# Altium project FMC_ADC_128CH_10B.PrjPCB (part 1 of 4)
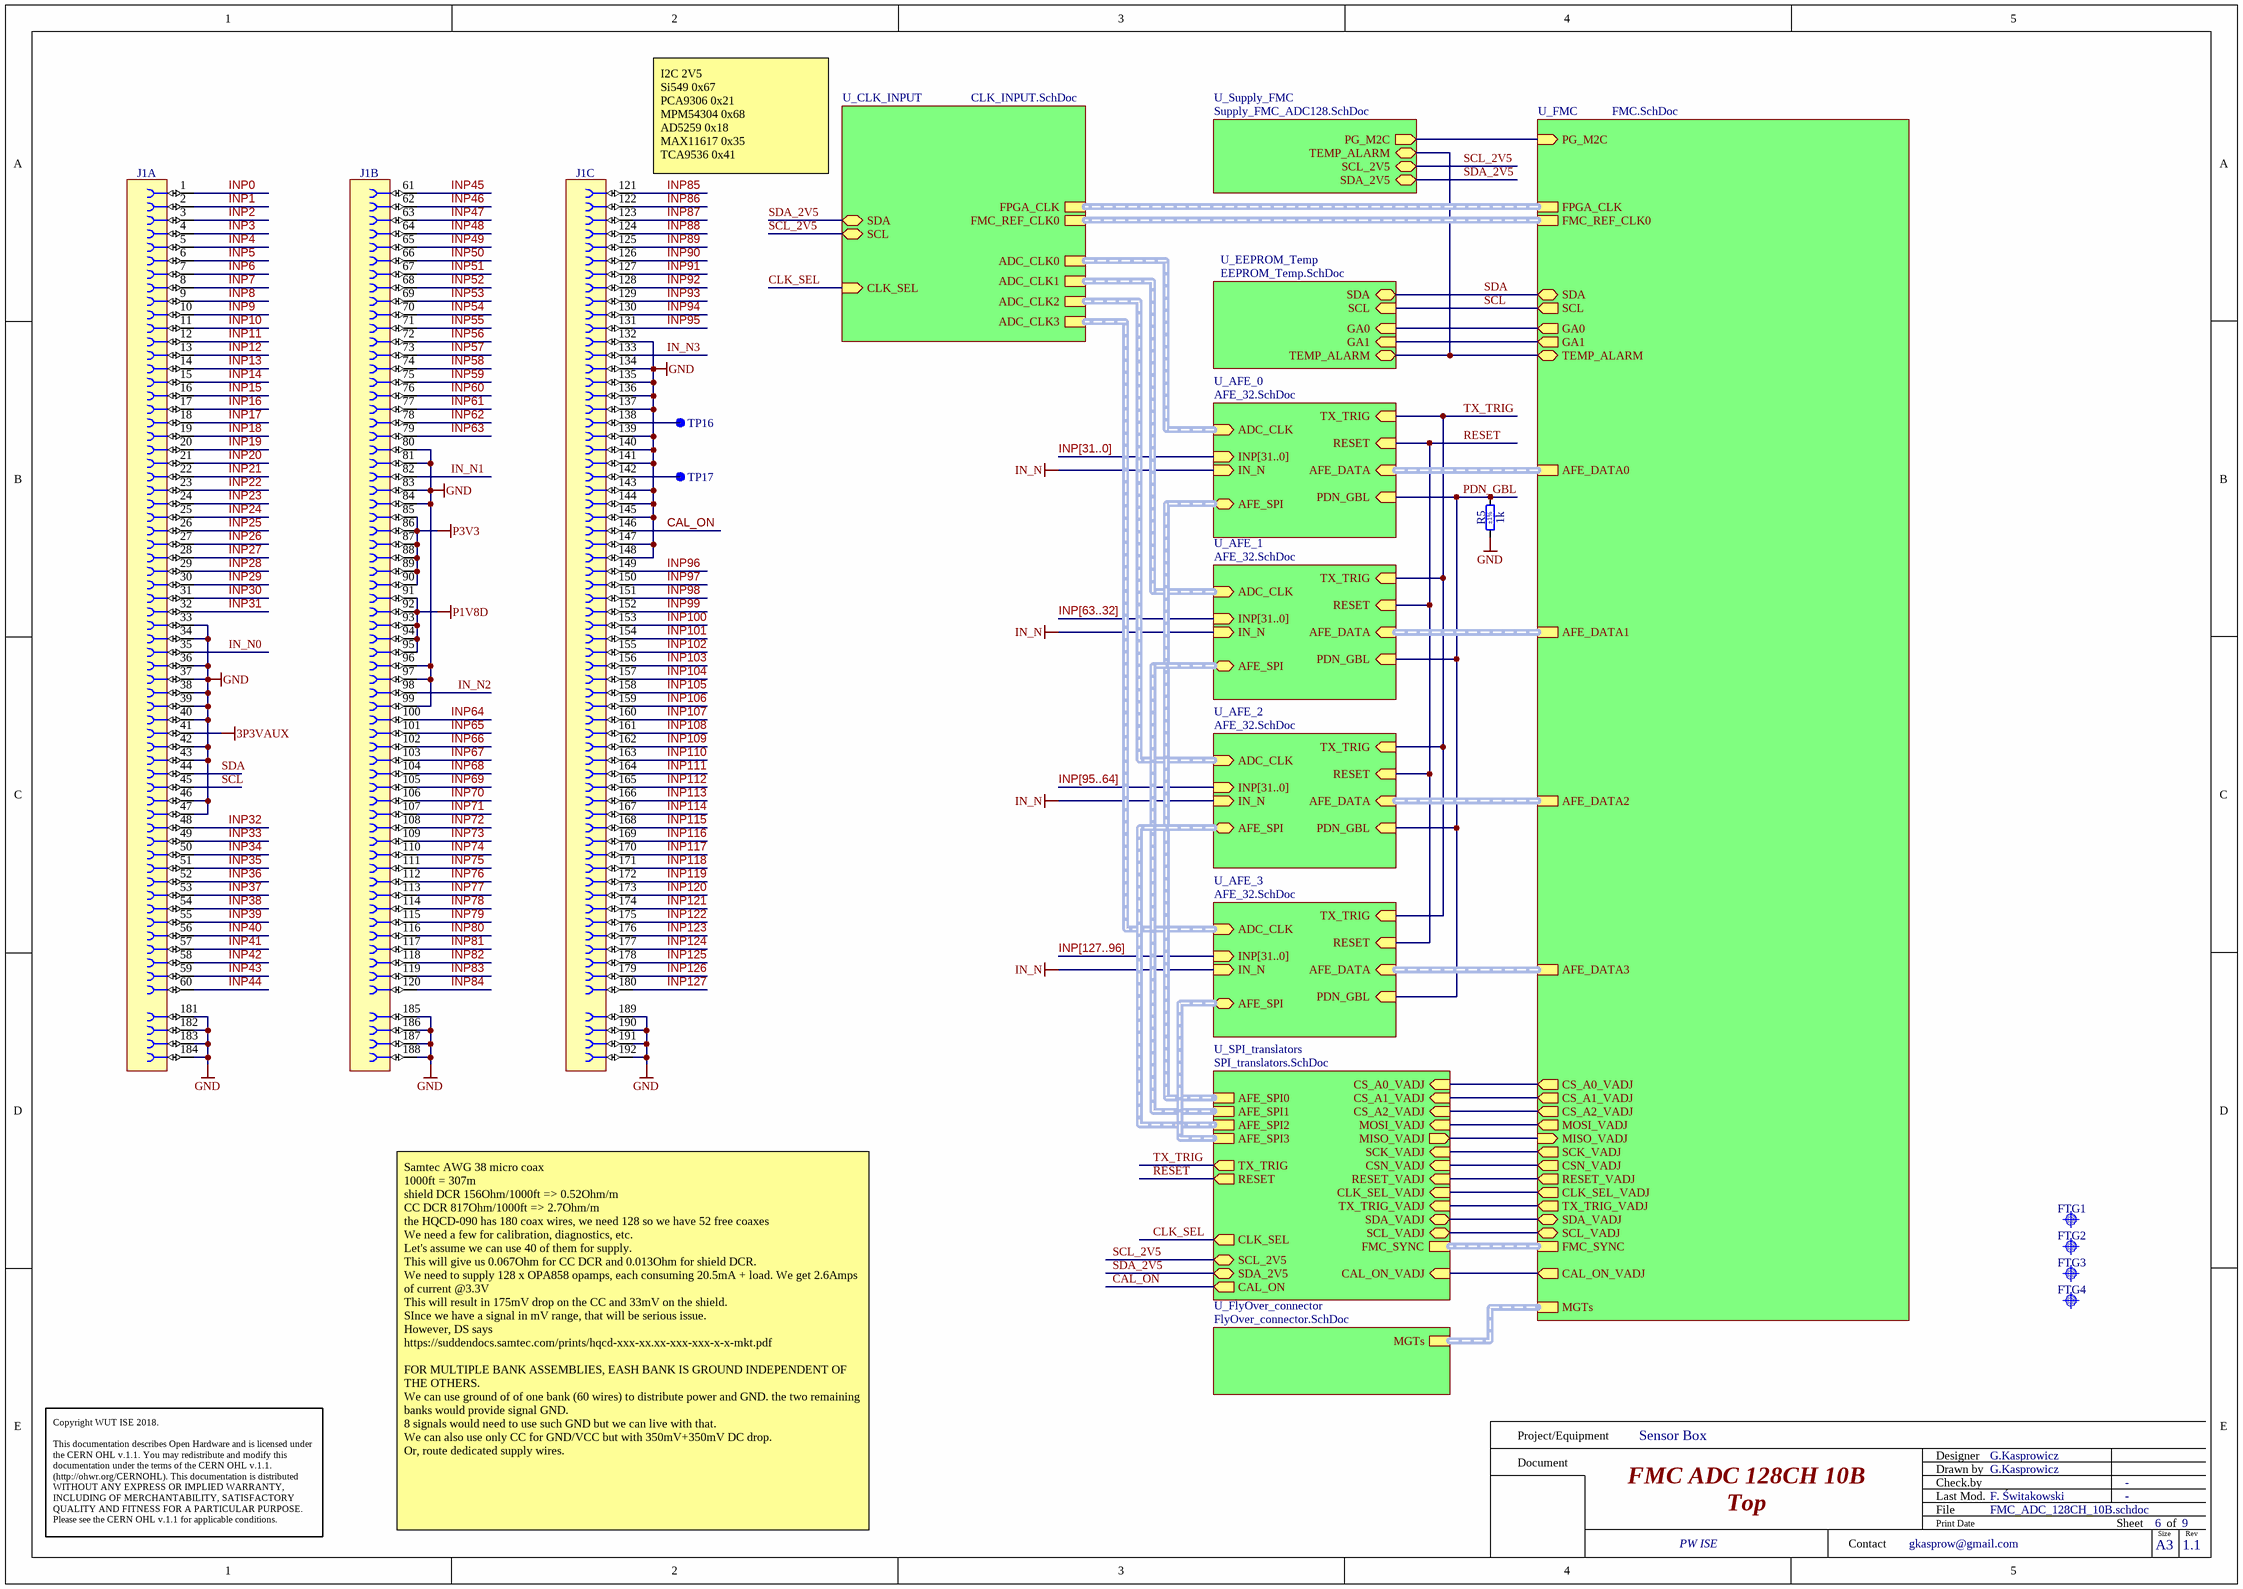
[diagram p0: FMC_ADC_128CH_10B.schdoc]
9 sheets, 821 parts. Net scope: hierarchical (ports join the sheet entries above them; power ports are global).
Board file: FMC_ADC_128CH_10B.PcbDoc
Sheets:
  FMC_ADC_128CH_10B.schdoc
    U_AFE_0 = AFE_32.SchDoc
      U_AFE_32_SUP = AFE_32_SUP.SchDoc
    U_Supply_FMC = Supply_FMC_ADC128.SchDoc
    U_CLK_INPUT = CLK_INPUT.SchDoc
    U_AFE_1 = AFE_32.SchDoc
      U_AFE_32_SUP = AFE_32_SUP.SchDoc
    U_AFE_2 = AFE_32.SchDoc
      U_AFE_32_SUP = AFE_32_SUP.SchDoc
    U_AFE_3 = AFE_32.SchDoc
      U_AFE_32_SUP = AFE_32_SUP.SchDoc
    U_FMC = FMC.SchDoc
    U_EEPROM_Temp = EEPROM_Temp.SchDoc
    U_SPI_translators = SPI_translators.SchDoc
    U_FlyOver_connector = FlyOver_connector.SchDoc

## Sheet FMC_ADC_128CH_10B.schdoc: FMC ADC 128CH 10B
size 420 x 297 mm; EDA_Number: ARTIQ; Projet: ARTIQ/SINARA; Author: G.Kasprowicz; CompanyName: WUT ISE; DrawnBy: G.Kasprowicz; Organization: WUT ISE; Address1: PW ISE; Address2: Nowowiejska 15/19 00-665 Warsaw; Address3: gkasprow@gmail.com; DocumentNumber: 6; Revision: 1.1; SheetNumber: 6; SheetTotal: 9; ModifiedBy: F. Świtakowski; CheckedDate: -; Title2: Top; DivGrp: WUT ISE; Designer: G.Kasprowicz; ModifiedDate: -; ProjectName: Sensor Box

### Parts
FTG1  Use only in PCB  [FIDUCIAL_TOP_C100-200]  (value not drawn)  (no BOM)
FTG2  Use only in PCB  [FIDUCIAL_TOP_S100-200]  (value not drawn)  (no BOM)
FTG3  Use only in PCB  [FIDUCIAL_TOP_C100-200]  (value not drawn)  (no BOM)
FTG4  Use only in PCB  [FIDUCIAL_TOP_S100-200]  (value not drawn)  (no BOM)
J1  (no value)  [SAMTEC_QSH-090-01-L-D-A]  (parts A,B,C of 3)
R5  1k  Tolerance: ±1%  [RESC1005X40N]
TP16  SMD Pad  [C100]  (value not drawn)
TP17  SMD Pad  [C100]  (value not drawn)

### Sub-sheets
U_AFE_0 = AFE_32.SchDoc: PDN_GBL (in), ADC_CLK (in, harness DIFF), INP[31..0] (in), AFE_DATA (in, harness AFE_DATA), RESET (in), AFE_SPI (bidir, harness AFE_SPI), TX_TRIG (in), IN_N (in)
U_AFE_1 = AFE_32.SchDoc: PDN_GBL (in), ADC_CLK (in, harness DIFF), INP[31..0] (in), AFE_DATA (in, harness AFE_DATA), RESET (in), AFE_SPI (bidir, harness AFE_SPI), TX_TRIG (in), IN_N (in)
U_AFE_2 = AFE_32.SchDoc: PDN_GBL (in), ADC_CLK (in, harness DIFF), INP[31..0] (in), AFE_DATA (in, harness AFE_DATA), RESET (in), AFE_SPI (bidir, harness AFE_SPI), TX_TRIG (in), IN_N (in)
U_AFE_3 = AFE_32.SchDoc: PDN_GBL (in), ADC_CLK (in, harness DIFF), INP[31..0] (in), AFE_DATA (in, harness AFE_DATA), RESET (in), AFE_SPI (bidir, harness AFE_SPI), TX_TRIG (in), IN_N (in)
U_CLK_INPUT = CLK_INPUT.SchDoc: ADC_CLK0 (harness DIFFCLK), ADC_CLK1 (harness DIFFCLK), ADC_CLK2 (harness DIFFCLK), ADC_CLK3 (harness DIFFCLK), FMC_REF_CLK0 (harness DIFFCLK), FPGA_CLK (harness DIFFCLK), SCL (bidir), CLK_SEL (in), SDA (bidir)
U_EEPROM_Temp = EEPROM_Temp.SchDoc: SDA (bidir), SCL (in), GA0 (in), GA1 (in), TEMP_ALARM (bidir)
U_FlyOver_connector = FlyOver_connector.SchDoc: MGTs (harness MGTs)
U_FMC = FMC.SchDoc: GA0 (out), GA1 (out), SDA (bidir), SCL (out), TEMP_ALARM (bidir), FPGA_CLK (harness DIFF), PG_M2C (in), FMC_SYNC (harness DIFF), FMC_REF_CLK0 (harness DIFF), AFE_DATA0 (harness AFE_DATA), AFE_DATA1 (harness AFE_DATA), AFE_DATA2 (harness AFE_DATA), AFE_DATA3 (harness AFE_DATA), CS_A0_VADJ (out), CS_A1_VADJ (out), CS_A2_VADJ (out), MOSI_VADJ (out), MISO_VADJ (in), SCK_VADJ (out), RESET_VADJ (out), TX_TRIG_VADJ (out), SDA_VADJ (bidir), SCL_VADJ (bidir), CSN_VADJ (out), CLK_SEL_VADJ (out), CAL_ON_VADJ (out), MGTs (harness MGTs)
U_SPI_translators = SPI_translators.SchDoc: AFE_SPI0 (harness AFE_SPI), AFE_SPI1 (harness AFE_SPI), AFE_SPI2 (harness AFE_SPI), AFE_SPI3 (harness AFE_SPI), TX_TRIG (out), RESET (out), MOSI_VADJ (in), SCK_VADJ (in), RESET_VADJ (in), CS_A0_VADJ (in), CS_A1_VADJ (in), MISO_VADJ (out), CS_A2_VADJ (in), TX_TRIG_VADJ (in), CSN_VADJ (in), SCL_VADJ (bidir), SDA_VADJ (bidir), CLK_SEL (out), CLK_SEL_VADJ (in), FMC_SYNC (harness DIFF), CAL_ON_VADJ (in), SCL_2V5 (bidir), SDA_2V5 (bidir), CAL_ON (out)
U_Supply_FMC = Supply_FMC_ADC128.SchDoc: PG_M2C (out), TEMP_ALARM (bidir), SCL_2V5 (bidir), SDA_2V5 (bidir)

### Nets
3P3VAUX: J1.41
GND: J1.33 J1.34 J1.36 J1.37 J1.38 J1.39 J1.40 J1.42 J1.43 J1.46 J1.47 J1.80 J1.81 J1.83 J1.84 J1.96 J1.97 J1.99 J1.132 J1.134 J1.135 J1.136 J1.137 J1.139 J1.140 J1.141 J1.143 J1.144 J1.145 J1.147 J1.148 J1.181 J1.182 J1.183 J1.184 J1.185 J1.186 J1.187 J1.188 J1.189 J1.190 J1.191 J1.192 R5.1
IN_N: sheet U_AFE_0/IN_N, sheet U_AFE_1/IN_N, sheet U_AFE_2/IN_N, sheet U_AFE_3/IN_N
P1V8D: J1.91 J1.92 J1.93 J1.94 J1.95
P3V3: J1.85 J1.86 J1.87 J1.88 J1.89 J1.90
CAL_ON: J1.146 ; sheet U_SPI_translators/CAL_ON
CLK_SEL: sheet U_CLK_INPUT/CLK_SEL, sheet U_SPI_translators/CLK_SEL
EN_PWR: sheet U_Supply_FMC/TEMP_ALARM, sheet U_FMC/TEMP_ALARM, sheet U_EEPROM_Temp/TEMP_ALARM
GA0: sheet U_FMC/GA0, sheet U_EEPROM_Temp/GA0
GA1: sheet U_FMC/GA1, sheet U_EEPROM_Temp/GA1
HA19_N: sheet U_FMC/CS_A0_VADJ, sheet U_SPI_translators/CS_A0_VADJ
HA19_P: sheet U_FMC/CSN_VADJ, sheet U_SPI_translators/CSN_VADJ
HA20_N: sheet U_FMC/CS_A2_VADJ, sheet U_SPI_translators/CS_A2_VADJ
HA20_P: sheet U_FMC/CS_A1_VADJ, sheet U_SPI_translators/CS_A1_VADJ
HA21_N: sheet U_FMC/SCK_VADJ, sheet U_SPI_translators/SCK_VADJ
HA21_P: sheet U_FMC/MOSI_VADJ, sheet U_SPI_translators/MOSI_VADJ
HA22_N: sheet U_FMC/RESET_VADJ, sheet U_SPI_translators/RESET_VADJ
HA22_P: sheet U_FMC/MISO_VADJ, sheet U_SPI_translators/MISO_VADJ
HA23_P: sheet U_FMC/TX_TRIG_VADJ, sheet U_SPI_translators/TX_TRIG_VADJ
HB20_N: sheet U_FMC/CAL_ON_VADJ, sheet U_SPI_translators/CAL_ON_VADJ
HB20_P: sheet U_FMC/SDA_VADJ, sheet U_SPI_translators/SDA_VADJ
HB21_N: sheet U_FMC/SCL_VADJ, sheet U_SPI_translators/SCL_VADJ
HB21_P: sheet U_FMC/CLK_SEL_VADJ, sheet U_SPI_translators/CLK_SEL_VADJ
IN_N0: J1.35
IN_N1: J1.82
IN_N2: J1.98
IN_N3: J1.133
INP0: J1.1
INP1: J1.2
INP2: J1.3
INP3: J1.4
INP4: J1.5
INP5: J1.6
INP6: J1.7
INP7: J1.8
INP8: J1.9
INP9: J1.10
INP10: J1.11
INP11: J1.12
INP12: J1.13
INP13: J1.14
INP14: J1.15
INP15: J1.16
INP16: J1.17
INP17: J1.18
INP18: J1.19
INP19: J1.20
INP20: J1.21
INP21: J1.22
INP22: J1.23
INP23: J1.24
INP24: J1.25
INP25: J1.26
INP26: J1.27
INP27: J1.28
INP28: J1.29
INP29: J1.30
INP30: J1.31
INP31: J1.32
INP32: J1.48  [project net INP0]
INP33: J1.49  [project net INP1]
INP34: J1.50  [project net INP2]
INP35: J1.51  [project net INP3]
INP36: J1.52
INP37: J1.53
INP38: J1.54
INP39: J1.55
INP40: J1.56
INP41: J1.57
INP42: J1.58  [project net INP10]
INP43: J1.59  [project net INP11]
INP44: J1.60  [project net INP12]
INP45: J1.61  [project net INP13]
INP46: J1.62  [project net INP14]
INP47: J1.63  [project net INP15]
INP48: J1.64  [project net INP16]
INP49: J1.65  [project net INP17]
INP50: J1.66  [project net INP18]
INP51: J1.67  [project net INP19]
INP52: J1.68  [project net INP20]
INP53: J1.69  [project net INP21]
INP54: J1.70  [project net INP22]
INP55: J1.71  [project net INP23]
INP56: J1.72  [project net INP24]
INP57: J1.73  [project net INP25]
INP58: J1.74  [project net INP26]
INP59: J1.75  [project net INP27]
INP60: J1.76  [project net INP28]
INP61: J1.77  [project net INP29]
INP62: J1.78  [project net INP30]
INP63: J1.79  [project net INP31]
INP64: J1.100  [project net INP0]
INP65: J1.101  [project net INP1]
INP66: J1.102  [project net INP2]
INP67: J1.103  [project net INP3]
INP68: J1.104  [project net INP4]
INP69: J1.105  [project net INP5]
INP70: J1.106  [project net INP6]
INP71: J1.107  [project net INP7]
INP72: J1.108
INP73: J1.109
INP74: J1.110  [project net INP10]
INP75: J1.111  [project net INP11]
INP76: J1.112  [project net INP12]
INP77: J1.113  [project net INP13]
INP78: J1.114  [project net INP14]
INP79: J1.115  [project net INP15]
INP80: J1.116  [project net INP16]
INP81: J1.117  [project net INP17]
INP82: J1.118  [project net INP18]
INP83: J1.119  [project net INP19]
INP84: J1.120  [project net INP20]
INP85: J1.121  [project net INP21]
INP86: J1.122  [project net INP22]
INP87: J1.123  [project net INP23]
INP88: J1.124  [project net INP24]
INP89: J1.125  [project net INP25]
INP90: J1.126  [project net INP26]
INP91: J1.127  [project net INP27]
INP92: J1.128  [project net INP28]
INP93: J1.129  [project net INP29]
INP94: J1.130  [project net INP30]
INP95: J1.131  [project net INP31]
INP96: J1.149  [project net INP0]
INP97: J1.150  [project net INP1]
INP98: J1.151  [project net INP2]
INP99: J1.152  [project net INP3]
INP100: J1.153
INP101: J1.154
INP102: J1.155
INP103: J1.156
INP104: J1.157
INP105: J1.158
INP106: J1.159  [project net INP10]
INP107: J1.160
INP108: J1.161
INP109: J1.162
INP110: J1.163
INP111: J1.164
INP112: J1.165
INP113: J1.166
INP114: J1.167
INP115: J1.168
INP116: J1.169
INP117: J1.170
INP118: J1.171
INP119: J1.172
INP120: J1.173
INP121: J1.174
INP122: J1.175
INP123: J1.176
INP124: J1.177
INP125: J1.178
INP126: J1.179
INP127: J1.180
PDN_GBL: R5.2 ; sheet U_AFE_0/PDN_GBL, sheet U_AFE_1/PDN_GBL, sheet U_AFE_2/PDN_GBL, sheet U_AFE_3/PDN_GBL
PG_M2C: sheet U_Supply_FMC/PG_M2C, sheet U_FMC/PG_M2C
RESET: sheet U_AFE_0/RESET, sheet U_AFE_1/RESET, sheet U_AFE_2/RESET, sheet U_AFE_3/RESET, sheet U_SPI_translators/RESET
SCL: J1.45 ; sheet U_FMC/SCL, sheet U_EEPROM_Temp/SCL
SCL_2V5: sheet U_Supply_FMC/SCL_2V5, sheet U_CLK_INPUT/SCL, sheet U_SPI_translators/SCL_2V5
SDA: J1.44 ; sheet U_FMC/SDA, sheet U_EEPROM_Temp/SDA
SDA_2V5: sheet U_Supply_FMC/SDA_2V5, sheet U_CLK_INPUT/SDA, sheet U_SPI_translators/SDA_2V5
TX_TRIG: sheet U_AFE_0/TX_TRIG, sheet U_AFE_1/TX_TRIG, sheet U_AFE_2/TX_TRIG, sheet U_AFE_3/TX_TRIG, sheet U_SPI_translators/TX_TRIG
NetJ1_138: J1.138 TP16.1
NetJ1_142: J1.142 TP17.1

### Buses and harness runs
bus INP[31..0] = sheet U_AFE_0/INP[31..0]
bus INP[63..32] = sheet U_AFE_1/INP[31..0]
bus INP[95..64] = sheet U_AFE_2/INP[31..0]
bus INP[127..96] = sheet U_AFE_3/INP[31..0]
harness sheet U_AFE_0/ADC_CLK = sheet U_CLK_INPUT/ADC_CLK0
harness sheet U_AFE_0/AFE_DATA = sheet U_FMC/AFE_DATA0
harness sheet U_AFE_0/AFE_SPI = sheet U_SPI_translators/AFE_SPI0
harness sheet U_AFE_1/ADC_CLK = sheet U_CLK_INPUT/ADC_CLK1
harness sheet U_AFE_1/AFE_DATA = sheet U_FMC/AFE_DATA1
harness sheet U_AFE_1/AFE_SPI = sheet U_SPI_translators/AFE_SPI1
harness sheet U_AFE_2/ADC_CLK = sheet U_CLK_INPUT/ADC_CLK2
harness sheet U_AFE_2/AFE_DATA = sheet U_FMC/AFE_DATA2
harness sheet U_AFE_2/AFE_SPI = sheet U_SPI_translators/AFE_SPI2
harness sheet U_AFE_3/ADC_CLK = sheet U_CLK_INPUT/ADC_CLK3
harness sheet U_AFE_3/AFE_DATA = sheet U_FMC/AFE_DATA3
harness sheet U_AFE_3/AFE_SPI = sheet U_SPI_translators/AFE_SPI3
harness sheet U_CLK_INPUT/FMC_REF_CLK0 = sheet U_FMC/FMC_REF_CLK0
harness sheet U_CLK_INPUT/FPGA_CLK = sheet U_FMC/FPGA_CLK
harness sheet U_FlyOver_connector/MGTs = sheet U_FMC/MGTs
harness sheet U_FMC/FMC_SYNC = sheet U_SPI_translators/FMC_SYNC

### Notes on the sheet
- (near J1) I2C 2V5
  Si549 0x67
  PCA9306 0x21
  MPM54304 0x68
  AD5259 0x18
  MAX11617 0x35
  TCA9536 0x41
- Samtec AWG 38 micro coax
  1000ft = 307m
  shield DCR 156Ohm/1000ft => 0.52Ohm/m
  CC DCR 817Ohm/1000ft => 2.7Ohm/m
  the HQCD-090 has 180 coax wires, we need 128 so we have 52 free coaxes
  We need a few for calibration, diagnostics, etc.
  Let's assume we can use 40 of them for supply.
  This will give us 0.067Ohm for CC DCR and 0.013Ohm for shield DCR.
  We need to supply 128 x OPA858 opamps, each consuming 20.5mA + load. We get 2.6Amps of current @3.3V
  This will result in 175mV drop on the CC and 33mV on the shield.
  SInce we have a signal in mV range, that will be serious issue.
  However, DS says
  https://suddendocs.samtec.com/prints/hqcd-xxx-xx.xx-xxx-xxx-x-x-mkt.pdf
  FOR MULTIPLE BANK ASSEMBLIES, EASH BANK IS GROUND INDEPENDENT OF THE OTHERS.
  We can use ground of of one bank (60 wires) to distribute power and GND. the two remaining banks would provide signal GND.
  8 signals would need to use such GND but we can live with that.
  We can also use only CC for GND/VCC but with 350mV+350mV DC drop.
  Or, route dedicated supply wires.
- Project/Equipment
- Document
- Designer
- Drawn by
- Check.by
- Copyright WUT ISE 2018.
  This documentation describes Open Hardware and is licensed under the CERN OHL v.1.1. You may redistribute and modify this documentation under the terms of the CERN OHL v.1.1. (http://ohwr.org/CERNOHL). This documentation is distributed WITHOUT ANY EXPRESS OR IMPLIED WARRANTY, INCLUDING OF MERCHANTABILITY, SATISFACTORY QUALITY AND FITNESS FOR A PARTICULAR PURPOSE. Please see the CERN OHL v.1.1 for applicable conditions.
- Contact
- File
- Last Mod.
- Print Date
- Sheet
- Size
- A3
- of
- Rev

### Library data of the parts
FTG1 FTG3 = FIDUCIAL_TARGET_C100-200: Fiducial Target; Part Description: Round Fiducial Target, Top Layer, 1.0mm, Top Solder 2.0mm, Keepout =2.0mm; Mounted: No; Part Number: FIDUCIAL_TARGET_C100-200; Component Type: Standard (No BOM); Pin Count: 1; Family: Fiducial; Socket: No; SMD: Yes; Sense: No; Status: None; ComponentHeight: 0mm; HelpURL: Undefined; Author: CERN DEM JLC; CreateDate: 09.02.2010; LatestRevisionDate: 04.04.2012; PackageDescription: Round Fiducial Target, Top Layer, 1.0mm, Top Solder 2.0mm, Keepout =2.0mm
FTG2 FTG4 = FIDUCIAL_TARGET_S100-200: Fiducial Target; Part Description: Square Fiducial Target, Top Layer, 1.0mm, Top Solder 2.0mm, Keepout =2.0mm; Mounted: No; Part Number: FIDUCIAL_TARGET_S100-200; Component Type: Standard (No BOM); Pin Count: 1; Family: Fiducial; Socket: No; SMD: Yes; Sense: No; Status: None; ComponentHeight: 0mm; HelpURL: Undefined; Author: CERN DEM JLC; CreateDate: 09.02.2010; LatestRevisionDate: 04.04.2012; PackageDescription: Square Fiducial Target, Top Layer, 1.0mm, Top Solder 2.0mm, Keepout =2.0mm
J1 = SAMTEC_QSH-090-01-L-D-A: Connector 180 Female (3x60) + 3x4 GND; Part Description: 180 Contacts ((2X30)x3), Pitch 0.5mm, Straight Double Row High Speed Ground Plane Socket; Manufacturer: SAMTEC; PressFit: No; Part Number: SAMTEC_QSH-090-01-L-D-A; Component Kind: Standard; Component Type: Standard; Pin Count: 192; Mounted: Yes; Socket: No; SMD: Yes; Sense: No; Status: None; Manufacturer Part Number: QSH-090-01-L-D-A; ComponentHeight: 3.25mm; HelpURL: \\cern.ch\dfs\Applications\Altium\Datasheets\SAMTEC_QSH-090-01-L-D-A.pdf; Author: CERN DEM MR; CreateDate: 08.09.2017; LatestRevisionDate: 08.09.2017
R5 = R0402_1K_1%_0.0625W_100PPM: Resistor - 1%; Part Description: General Purpose Thick Film Chip Resistor; Manufacturer: GENERIC; Manufacturer1 Part Number: 232270671002L; TC: ±100ppm/°C; PressFit: No; Part Number: R0402_1K_1%_0.0625W_100PPM; Component Kind: Standard; Component Type: Standard; Pin Count: 2; Value: 1k; Status: Not Recommended; Power: 0.0625W; Manufacturer Part Number: R0402_1K_1%_0.0625W_100PPM; Case: 0402; Mounted: Yes; Sense: No; Socket: No; SMD: Yes; Manufacturer1 Example: YAGEO PHYCOMP; Manufacturer1 ComponentHeight: 0.4mm; HelpURL: \\cern.ch\dfs\Applications\Altium\Datasheets\R0402_Phycomp_RC0402.pdf; Author: CERN DEM JLC; CreateDate: 03.12.2007; LatestRevisionDate: 17.10.2012
TP16 TP17 = SMD_PAD_D1MM: Pad; Part Description: 1mm Diameter SMD Pad; Mounted: No; Part Number: SMD_PAD_D1MM; Component Kind: Standard (No BOM); Component Type: Standard (No BOM); Pin Count: 1; Family: SMD Pad; Socket: No; SMD: Yes; Sense: No; Status: None; ComponentHeight: 0mm; HelpURL: Undefined; Author: CERN DEM JLC; CreateDate: 10.10.2017; LatestRevisionDate: 10.10.2017; PackageDescription: 1mm Diameter SMD Pad

## Sheet AFE_32.SchDoc: FMC ADC 128CH 10B
size 420 x 297 mm; Author: G.Kasprowicz; CompanyName: WUT ISE; DrawnBy: G.Kasprowicz; Organization: WUT ISE; Address1: PW ISE; Address2: Nowowiejska 15/19 00-665 Warsaw; Address3: gkasprow@gmail.com; DocumentNumber: 2; Revision: 1; SheetNumber: 2; SheetTotal: 9; ModifiedBy: -; CheckedDate: -; Title2: AFE 32CH; DivGrp: WUT ISE; Designer: G.Kasprowicz; ModifiedDate: -; ProjectName: Sensor Box
Used 4 times, as channels U_AFE_0, U_AFE_1, U_AFE_2, U_AFE_3. Parts and nets are listed once, with the designators drawn on the sheet.
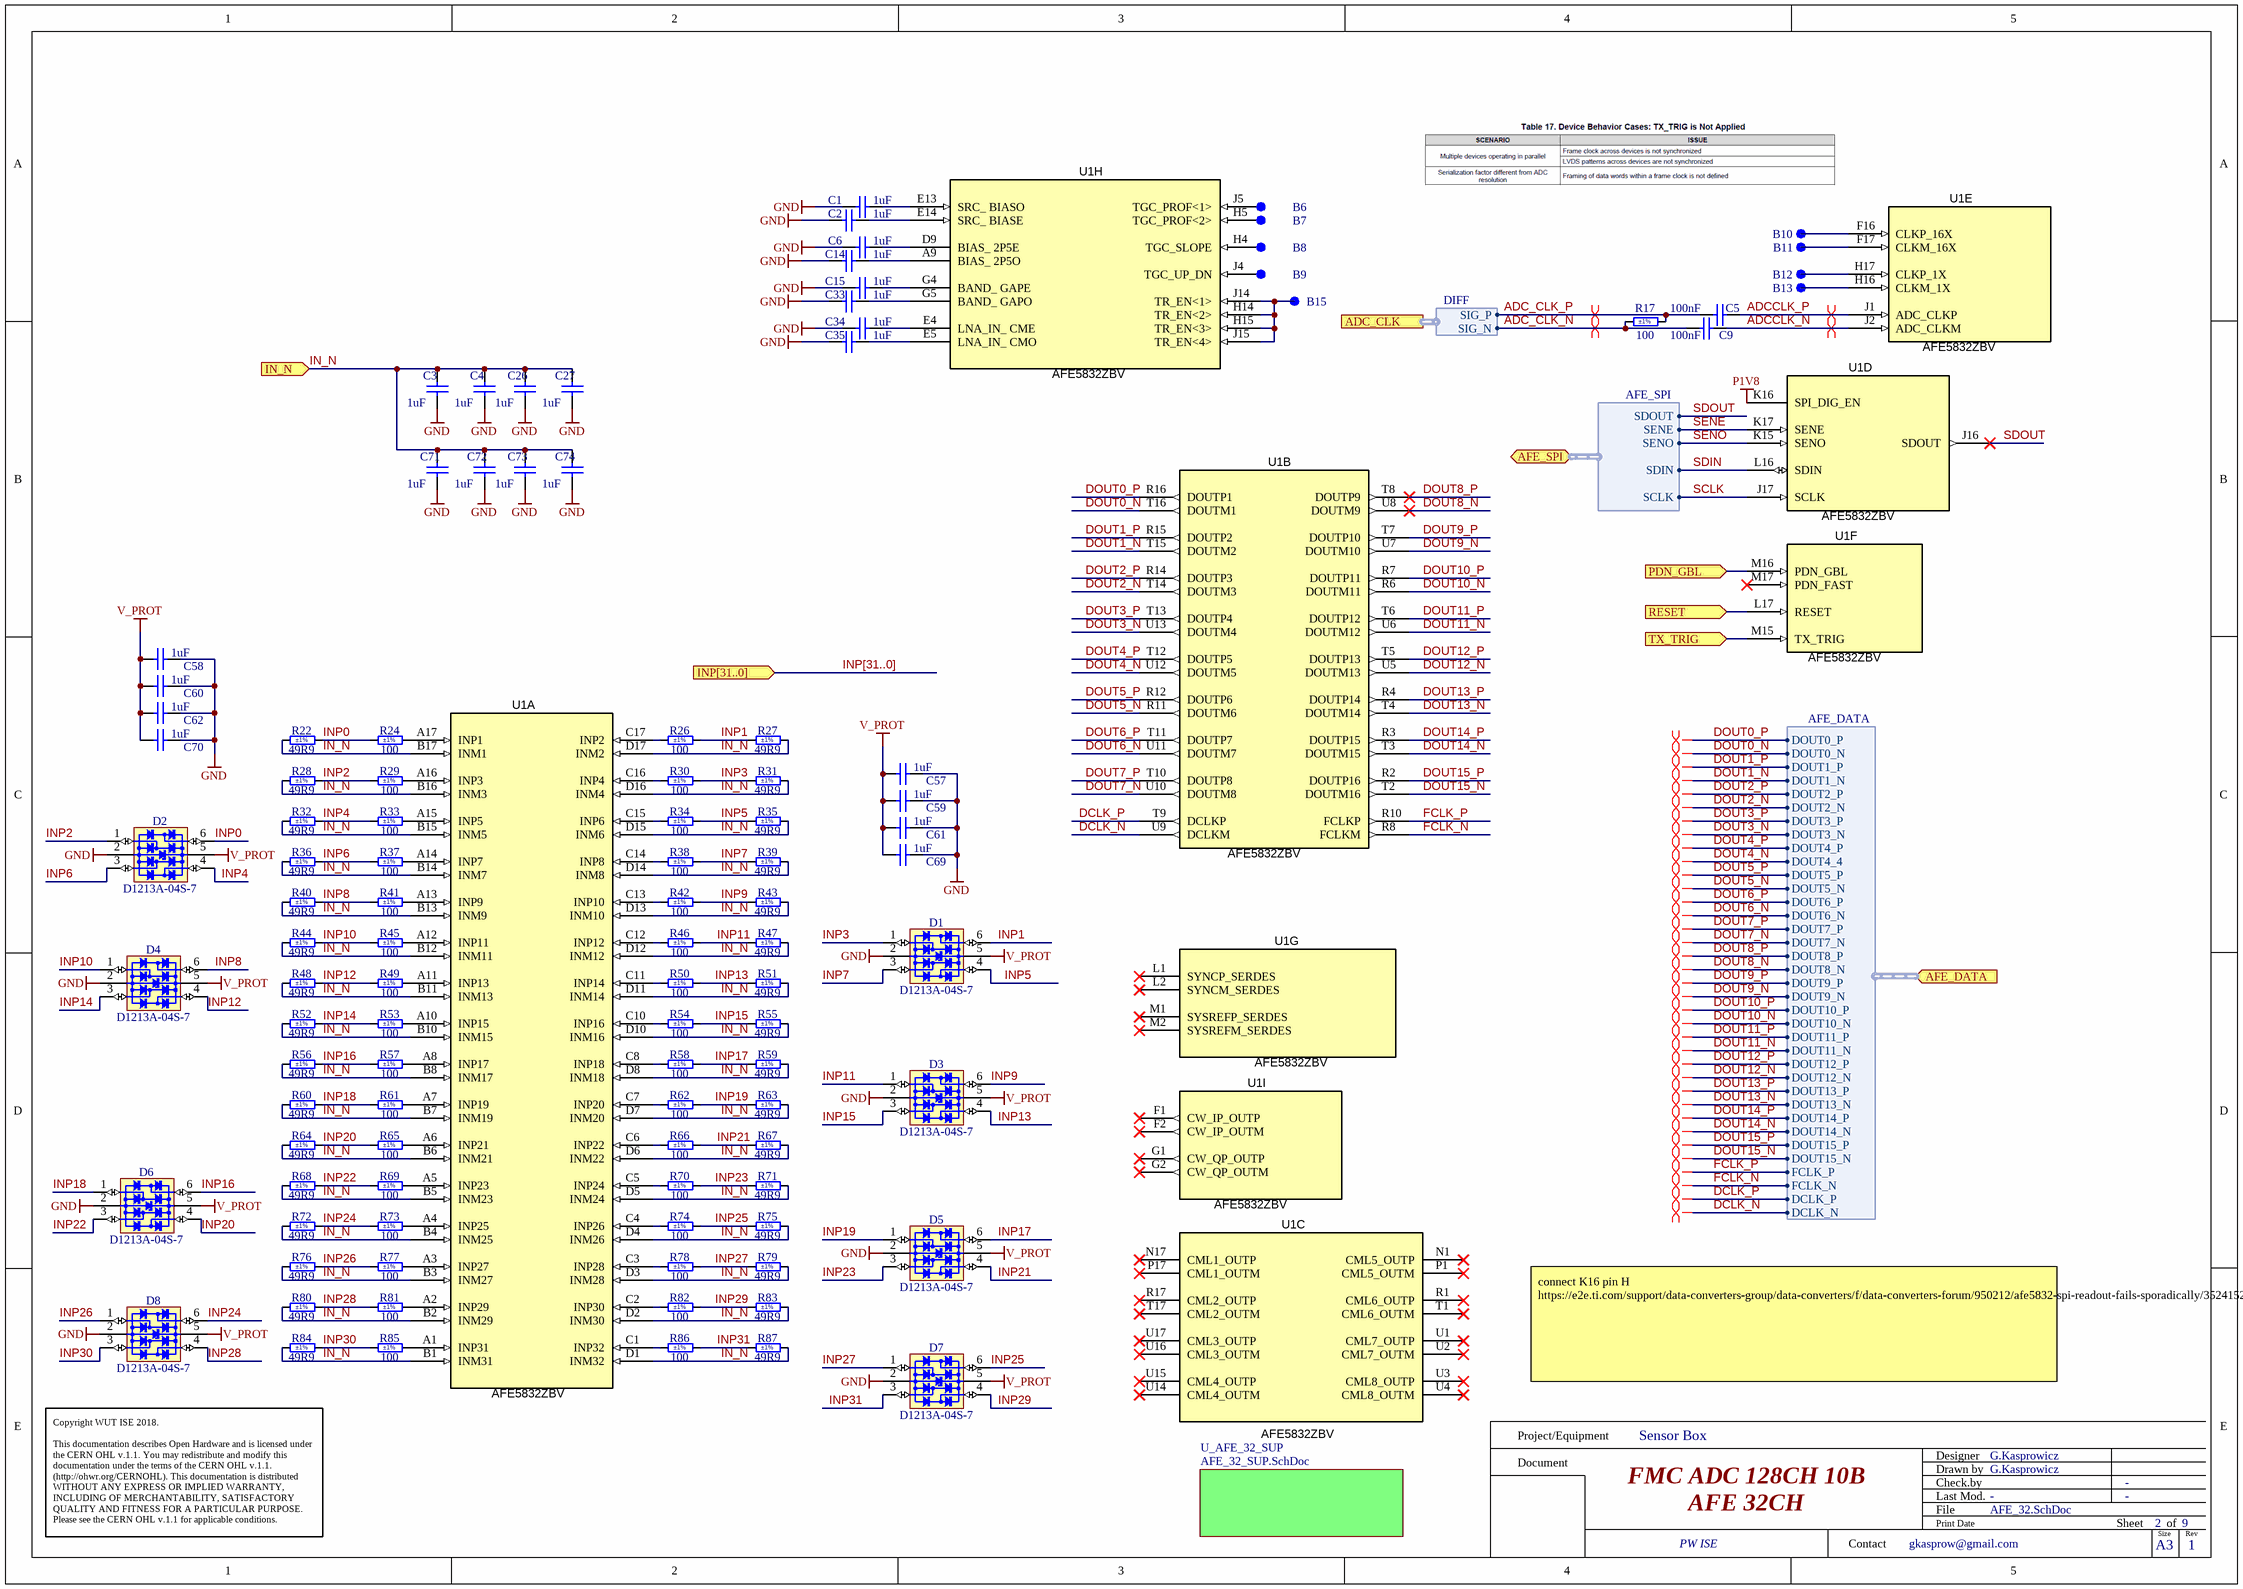
[diagram p1: AFE_32.SchDoc]

### Parts
B6  SMD Pad  [C75]  (value not drawn)  (no BOM)
B7  SMD Pad  [C75]  (value not drawn)  (no BOM)
B8  SMD Pad  [C75]  (value not drawn)  (no BOM)
B9  SMD Pad  [C75]  (value not drawn)  (no BOM)
B10  SMD Pad  [C75]  (value not drawn)  (no BOM)
B11  SMD Pad  [C75]  (value not drawn)  (no BOM)
B12  SMD Pad  [C75]  (value not drawn)  (no BOM)
B13  SMD Pad  [C75]  (value not drawn)  (no BOM)
B15  SMD Pad  [C75]  (value not drawn)  (no BOM)
C1  1uF  [CAPC1005X55N]
C2  1uF  [CAPC1005X55N]
C3  1uF  [CAPC1005X55N]
C4  1uF  [CAPC1005X55N]
C5  100nF  [CAPC0603X33N]
C6  1uF  [CAPC1005X55N]
C9  100nF  [CAPC0603X33N]
C14  1uF  [CAPC1005X55N]
C15  1uF  [CAPC1005X55N]
C26  1uF  [CAPC1005X55N]
C27  1uF  [CAPC1005X55N]
C33  1uF  [CAPC1005X55N]
C34  1uF  [CAPC1005X55N]
C35  1uF  [CAPC1005X55N]
C57  1uF  [CAPC1005X55N]
C58  1uF  [CAPC1005X55N]
C59  1uF  [CAPC1005X55N]
C60  1uF  [CAPC1005X55N]
C61  1uF  [CAPC1005X55N]
C62  1uF  [CAPC1005X55N]
C69  1uF  [CAPC1005X55N]
C70  1uF  [CAPC1005X55N]
C71  1uF  [CAPC1005X55N]
C72  1uF  [CAPC1005X55N]
C73  1uF  [CAPC1005X55N]
C74  1uF  [CAPC1005X55N]
D1  D1213A-04S-7  [SOT65P210X110-6N]
D2  D1213A-04S-7  [SOT65P210X110-6N]
D3  D1213A-04S-7  [SOT65P210X110-6N]
D4  D1213A-04S-7  [SOT65P210X110-6N]
D5  D1213A-04S-7  [SOT65P210X110-6N]
D6  D1213A-04S-7  [SOT65P210X110-6N]
D7  D1213A-04S-7  [SOT65P210X110-6N]
D8  D1213A-04S-7  [SOT65P210X110-6N]
R17  100  Tolerance: ±1%  [RESC1005X40N]
R22  49R9  Tolerance: ±1%  [RESC0603X28N]
R24  100  Tolerance: ±1%  [RESC0603X28N]
R26  100  Tolerance: ±1%  [RESC0603X28N]
R27  49R9  Tolerance: ±1%  [RESC0603X28N]
R28  49R9  Tolerance: ±1%  [RESC0603X28N]
R29  100  Tolerance: ±1%  [RESC0603X28N]
R30  100  Tolerance: ±1%  [RESC0603X28N]
R31  49R9  Tolerance: ±1%  [RESC0603X28N]
R32  49R9  Tolerance: ±1%  [RESC0603X28N]
R33  100  Tolerance: ±1%  [RESC0603X28N]
R34  100  Tolerance: ±1%  [RESC0603X28N]
R35  49R9  Tolerance: ±1%  [RESC0603X28N]
R36  49R9  Tolerance: ±1%  [RESC0603X28N]
R37  100  Tolerance: ±1%  [RESC0603X28N]
R38  100  Tolerance: ±1%  [RESC0603X28N]
R39  49R9  Tolerance: ±1%  [RESC0603X28N]
R40  49R9  Tolerance: ±1%  [RESC0603X28N]
R41  100  Tolerance: ±1%  [RESC0603X28N]
R42  100  Tolerance: ±1%  [RESC0603X28N]
R43  49R9  Tolerance: ±1%  [RESC0603X28N]
R44  49R9  Tolerance: ±1%  [RESC0603X28N]
R45  100  Tolerance: ±1%  [RESC0603X28N]
R46  100  Tolerance: ±1%  [RESC0603X28N]
R47  49R9  Tolerance: ±1%  [RESC0603X28N]
R48  49R9  Tolerance: ±1%  [RESC0603X28N]
R49  100  Tolerance: ±1%  [RESC0603X28N]
R50  100  Tolerance: ±1%  [RESC0603X28N]
R51  49R9  Tolerance: ±1%  [RESC0603X28N]
R52  49R9  Tolerance: ±1%  [RESC0603X28N]
R53  100  Tolerance: ±1%  [RESC0603X28N]
R54  100  Tolerance: ±1%  [RESC0603X28N]
R55  49R9  Tolerance: ±1%  [RESC0603X28N]
R56  49R9  Tolerance: ±1%  [RESC0603X28N]
R57  100  Tolerance: ±1%  [RESC0603X28N]
R58  100  Tolerance: ±1%  [RESC0603X28N]
R59  49R9  Tolerance: ±1%  [RESC0603X28N]
R60  49R9  Tolerance: ±1%  [RESC0603X28N]
R61  100  Tolerance: ±1%  [RESC0603X28N]
R62  100  Tolerance: ±1%  [RESC0603X28N]
R63  49R9  Tolerance: ±1%  [RESC0603X28N]
R64  49R9  Tolerance: ±1%  [RESC0603X28N]
R65  100  Tolerance: ±1%  [RESC0603X28N]
R66  100  Tolerance: ±1%  [RESC0603X28N]
R67  49R9  Tolerance: ±1%  [RESC0603X28N]
R68  49R9  Tolerance: ±1%  [RESC0603X28N]
R69  100  Tolerance: ±1%  [RESC0603X28N]
R70  100  Tolerance: ±1%  [RESC0603X28N]
R71  49R9  Tolerance: ±1%  [RESC0603X28N]
R72  49R9  Tolerance: ±1%  [RESC0603X28N]
R73  100  Tolerance: ±1%  [RESC0603X28N]
R74  100  Tolerance: ±1%  [RESC0603X28N]
R75  49R9  Tolerance: ±1%  [RESC0603X28N]
R76  49R9  Tolerance: ±1%  [RESC0603X28N]
R77  100  Tolerance: ±1%  [RESC0603X28N]
R78  100  Tolerance: ±1%  [RESC0603X28N]
R79  49R9  Tolerance: ±1%  [RESC0603X28N]
R80  49R9  Tolerance: ±1%  [RESC0603X28N]
R81  100  Tolerance: ±1%  [RESC0603X28N]
R82  100  Tolerance: ±1%  [RESC0603X28N]
R83  49R9  Tolerance: ±1%  [RESC0603X28N]
R84  49R9  Tolerance: ±1%  [RESC0603X28N]
R85  100  Tolerance: ±1%  [RESC0603X28N]
R86  100  Tolerance: ±1%  [RESC0603X28N]
R87  49R9  Tolerance: ±1%  [RESC0603X28N]
U1  AFE5832ZBV  [BGA289C80P17X17_1500X1500X140]  (parts A,B,C,D,E,F,G,H,I of 13)

### Sub-sheets
U_AFE_32_SUP = AFE_32_SUP.SchDoc: no entries

### Ports
ADC_CLK (harness DIFF), AFE_DATA (in, harness AFE_DATA), AFE_SPI (bidir, harness AFE_SPI), IN_N (in), INP[31..0] (in), PDN_GBL (in), RESET (in), TX_TRIG (in)

### Harnesses
AFE_SPI: SDOUT, SENE, SENO, SDIN, SCLK
DIFF: SIG_P, SIG_N
AFE_DATA: DOUT0_P, DOUT0_N, DOUT1_P, DOUT1_N, DOUT2_P, DOUT2_N, DOUT3_P, DOUT3_N, DOUT4_P, DOUT4_4, DOUT5_P, DOUT5_N, DOUT6_P, DOUT6_N, DOUT7_P, DOUT7_N, DOUT8_P, DOUT8_N, DOUT9_P, DOUT9_N, DOUT10_P, DOUT10_N, DOUT11_P, DOUT11_N, DOUT12_P, DOUT12_N, DOUT13_P, DOUT13_N, DOUT14_P, DOUT14_N, DOUT15_P, DOUT15_N, FCLK_P, FCLK_N, DCLK_P, DCLK_N

### Nets
GND: C1.1 C2.1 C3.2 C4.2 C6.1 C14.1 C15.1 C26.2 C27.2 C33.1 C34.1 C35.1 C57.2 C58.2 C59.2 C60.2 C61.2 C62.2 C69.2 C70.2 C71.2 C72.2 C73.2 C74.2 D1.2(GND) D2.2(GND) D3.2(GND) D4.2(GND) D5.2(GND) D6.2(GND) D7.2(GND) D8.2(GND)
P1V8: U1.K16(SPI_DIG_EN)
V_PROT: C57.1 C58.1 C59.1 C60.1 C61.1 C62.1 C69.1 C70.1 D1.5(VBUS) D2.5(VBUS) D3.5(VBUS) D4.5(VBUS) D5.5(VBUS) D6.5(VBUS) D7.5(VBUS) D8.5(VBUS)
ADC_CLK_N: C9.1 R17.1 ; port ADC_CLK.SIG_N
ADC_CLK_P: C5.1 R17.2 ; port ADC_CLK.SIG_P
ADCCLK_N: C9.2 U1.J2(ADC_CLKM)
ADCCLK_P: C5.2 U1.J1(ADC_CLKP)
DCLK_N: U1.U9(DCLKM) ; port AFE_DATA.DCLK_N
DCLK_P: U1.T9(DCLKP) ; port AFE_DATA.DCLK_P
DOUT0_N: U1.T16(DOUTM1) ; port AFE_DATA.DOUT0_N
DOUT0_P: U1.R16(DOUTP1) ; port AFE_DATA.DOUT0_P
DOUT1_N: U1.T15(DOUTM2) ; port AFE_DATA.DOUT1_N
DOUT1_P: U1.R15(DOUTP2) ; port AFE_DATA.DOUT1_P
DOUT2_N: U1.T14(DOUTM3) ; port AFE_DATA.DOUT2_N
DOUT2_P: U1.R14(DOUTP3) ; port AFE_DATA.DOUT2_P
DOUT3_N: U1.U13(DOUTM4) ; port AFE_DATA.DOUT3_N
DOUT3_P: U1.T13(DOUTP4) ; port AFE_DATA.DOUT3_P
DOUT4_N: U1.U12(DOUTM5) ; port AFE_DATA.DOUT4_4
DOUT4_P: U1.T12(DOUTP5) ; port AFE_DATA.DOUT4_P
DOUT5_N: U1.R11(DOUTM6) ; port AFE_DATA.DOUT5_N
DOUT5_P: U1.R12(DOUTP6) ; port AFE_DATA.DOUT5_P
DOUT6_N: U1.U11(DOUTM7) ; port AFE_DATA.DOUT6_N
DOUT6_P: U1.T11(DOUTP7) ; port AFE_DATA.DOUT6_P
DOUT7_N: U1.U10(DOUTM8) ; port AFE_DATA.DOUT7_N
DOUT7_P: U1.T10(DOUTP8) ; port AFE_DATA.DOUT7_P
DOUT8_N: U1.U8(DOUTM9) ; port AFE_DATA.DOUT8_N
DOUT8_P: U1.T8(DOUTP9) ; port AFE_DATA.DOUT8_P
DOUT9_N: U1.U7(DOUTM10) ; port AFE_DATA.DOUT9_N
DOUT9_P: U1.T7(DOUTP10) ; port AFE_DATA.DOUT9_P
DOUT10_N: U1.R6(DOUTM11) ; port AFE_DATA.DOUT10_N
DOUT10_P: U1.R7(DOUTP11) ; port AFE_DATA.DOUT10_P
DOUT11_N: U1.U6(DOUTM12) ; port AFE_DATA.DOUT11_N
DOUT11_P: U1.T6(DOUTP12) ; port AFE_DATA.DOUT11_P
DOUT12_N: U1.U5(DOUTM13) ; port AFE_DATA.DOUT12_N
DOUT12_P: U1.T5(DOUTP13) ; port AFE_DATA.DOUT12_P
DOUT13_N: U1.T4(DOUTM14) ; port AFE_DATA.DOUT13_N
DOUT13_P: U1.R4(DOUTP14) ; port AFE_DATA.DOUT13_P
DOUT14_N: U1.T3(DOUTM15) ; port AFE_DATA.DOUT14_N
DOUT14_P: U1.R3(DOUTP15) ; port AFE_DATA.DOUT14_P
DOUT15_N: U1.T2(DOUTM16) ; port AFE_DATA.DOUT15_N
DOUT15_P: U1.R2(DOUTP16) ; port AFE_DATA.DOUT15_P
FCLK_N: U1.R8(FCLKM) ; port AFE_DATA.FCLK_N
FCLK_P: U1.R10(FCLKP) ; port AFE_DATA.FCLK_P
IN_N: C3.1 C4.1 C26.1 C27.1 C71.1 C72.1 C73.1 C74.1 R22.2 R27.2 R28.2 R31.2 R32.2 R35.2 R36.2 R39.2 R40.2 R43.2 R44.2 R47.2 R48.2 R51.2 R52.2 R55.2 R56.2 R59.2 R60.2 R63.2 R64.2 R67.2 R68.2 R71.2 R72.2 R75.2 R76.2 R79.2 R80.2 R83.2 R84.2 R87.2 U1.B1(INM31) U1.B2(INM29) U1.B3(INM27) U1.B4(INM25) U1.B5(INM23) U1.B6(INM21) U1.B7(INM19) U1.B8(INM17) U1.B10(INM15) U1.B11(INM13) U1.B12(INM11) U1.B13(INM9) U1.B14(INM7) U1.B15(INM5) U1.B16(INM3) U1.B17(INM1) U1.D1(INM32) U1.D2(INM30) U1.D3(INM28) U1.D4(INM26) U1.D5(INM24) U1.D6(INM22) U1.D7(INM20) U1.D8(INM18) U1.D10(INM16) U1.D11(INM14) U1.D12(INM12) U1.D13(INM10) U1.D14(INM8) U1.D15(INM6) U1.D16(INM4) U1.D17(INM2) ; port IN_N
INP0: D2.6(I/O4) R22.1 R24.1
INP1: D1.6(I/O4) R26.2 R27.1
INP2: D2.1(I/O1) R28.1 R29.1
INP3: D1.1(I/O1) R30.2 R31.1
INP4: D2.4(I/O3) R32.1 R33.1
INP5: D1.4(I/O3) R34.2 R35.1
INP6: D2.3(I/O2) R36.1 R37.1
INP7: D1.3(I/O2) R38.2 R39.1
INP8: D4.6(I/O4) R40.1 R41.1
INP9: D3.6(I/O4) R42.2 R43.1
INP10: D4.1(I/O1) R44.1 R45.1
INP11: D3.1(I/O1) R46.2 R47.1
INP12: D4.4(I/O3) R48.1 R49.1
INP13: D3.4(I/O3) R50.2 R51.1
INP14: D4.3(I/O2) R52.1 R53.1
INP15: D3.3(I/O2) R54.2 R55.1
INP16: D6.6(I/O4) R56.1 R57.1
INP17: D5.6(I/O4) R58.2 R59.1
INP18: D6.1(I/O1) R60.1 R61.1
INP19: D5.1(I/O1) R62.2 R63.1
INP20: D6.4(I/O3) R64.1 R65.1
INP21: D5.4(I/O3) R66.2 R67.1
INP22: D6.3(I/O2) R68.1 R69.1
INP23: D5.3(I/O2) R70.2 R71.1
INP24: D8.6(I/O4) R72.1 R73.1
INP25: D7.6(I/O4) R74.2 R75.1
INP26: D8.1(I/O1) R76.1 R77.1
INP27: D7.1(I/O1) R78.2 R79.1
INP28: D8.4(I/O3) R80.1 R81.1
INP29: D7.4(I/O3) R82.2 R83.1
INP30: D8.3(I/O2) R84.1 R85.1
INP31: D7.3(I/O2) R86.2 R87.1
PDN_GBL: U1.M16(PDN_GBL) ; port PDN_GBL
RESET: U1.L17(RESET) ; port RESET
SCLK: U1.J17(SCLK) ; port AFE_SPI.SCLK
SDIN: U1.L16(SDIN) ; port AFE_SPI.SDIN
SDOUT: U1.J16(SDOUT) ; port AFE_SPI.SDOUT
SENE: U1.K17(SENE) ; port AFE_SPI.SENE
SENO: U1.K15(SENO) ; port AFE_SPI.SENO
TX_TRIG: U1.M15(TX_TRIG) ; port TX_TRIG
NetB6_1: B6.1 U1.J5(TGC_PROF<1>)
NetB7_1: B7.1 U1.H5(TGC_PROF<2>)
NetB8_1: B8.1 U1.H4(TGC_SLOPE)
NetB9_1: B9.1 U1.J4(TGC_UP_DN)
NetB10_1: B10.1 U1.F16(CLKP_16X)
NetB11_1: B11.1 U1.F17(CLKM_16X)
NetB12_1: B12.1 U1.H17(CLKP_1X)
NetB13_1: B13.1 U1.H16(CLKM_1X)
NetB15_1: B15.1 U1.H14(TR_EN<2>) U1.H15(TR_EN<3>) U1.J14(TR_EN<1>) U1.J15(TR_EN<4>)
NetC1_2: C1.2 U1.E13(SRC__BIASO)
NetC2_2: C2.2 U1.E14(SRC__BIASE)
NetC6_2: C6.2 U1.D9(BIAS__2P5E)
NetC14_2: C14.2 U1.A9(BIAS__2P5O)
NetC15_2: C15.2 U1.G4(BAND__GAPE)
NetC33_2: C33.2 U1.G5(BAND__GAPO)
NetC34_2: C34.2 U1.E4(LNA_IN__CME)
NetC35_2: C35.2 U1.E5(LNA_IN__CMO)
NetR24_2: R24.2 U1.A17(INP1)
NetR26_1: R26.1 U1.C17(INP2)
NetR29_2: R29.2 U1.A16(INP3)
NetR30_1: R30.1 U1.C16(INP4)
NetR33_2: R33.2 U1.A15(INP5)
NetR34_1: R34.1 U1.C15(INP6)
NetR37_2: R37.2 U1.A14(INP7)
NetR38_1: R38.1 U1.C14(INP8)
NetR41_2: R41.2 U1.A13(INP9)
NetR42_1: R42.1 U1.C13(INP10)
NetR45_2: R45.2 U1.A12(INP11)
NetR46_1: R46.1 U1.C12(INP12)
NetR49_2: R49.2 U1.A11(INP13)
NetR50_1: R50.1 U1.C11(INP14)
NetR53_2: R53.2 U1.A10(INP15)
NetR54_1: R54.1 U1.C10(INP16)
NetR57_2: R57.2 U1.A8(INP17)
NetR58_1: R58.1 U1.C8(INP18)
NetR61_2: R61.2 U1.A7(INP19)
NetR62_1: R62.1 U1.C7(INP20)
NetR65_2: R65.2 U1.A6(INP21)
NetR66_1: R66.1 U1.C6(INP22)
NetR69_2: R69.2 U1.A5(INP23)
NetR70_1: R70.1 U1.C5(INP24)
NetR73_2: R73.2 U1.A4(INP25)
NetR74_1: R74.1 U1.C4(INP26)
NetR77_2: R77.2 U1.A3(INP27)
NetR78_1: R78.1 U1.C3(INP28)
NetR81_2: R81.2 U1.A2(INP29)
NetR82_1: R82.1 U1.C2(INP30)
NetR85_2: R85.2 U1.A1(INP31)
NetR86_1: R86.1 U1.C1(INP32)

Not connected (* = marked no-connect by the designer): U1 F1(CW_IP_OUTP)* F2(CW_IP_OUTM)* G1(CW_QP_OUTP)* G2(CW_QP_OUTM)* L1(SYNCP_SERDES)* L2(SYNCM_SERDES)* M1(SYSREFP_SERDES)* M2(SYSREFM_SERDES)* M17(PDN_FAST)* N1(CML5_OUTP)* N17(CML1_OUTP)* P1(CML5_OUTM)* P17(CML1_OUTM)* R1(CML6_OUTP)* R17(CML2_OUTP)* T1(CML6_OUTM)* T17(CML2_OUTM)* U1(CML7_OUTP)* U2(CML7_OUTM)* U3(CML8_OUTP)* U4(CML8_OUTM)* U14(CML4_OUTM)* U15(CML4_OUTP)* U16(CML3_OUTM)* U17(CML3_OUTP)*

### Channels
U_AFE_0: designators B6=B6A B7=B7A B8=B8A B9=B9A B10=B10A B11=B11A B12=B12A B13=B13A B15=B15A C1=C1A C2=C2A C3=C3A C4=C4A C5=C5A C6=C6A C9=C9A C14=C14A C15=C15A C26=C26A C27=C27A C33=C33A C34=C34A C35=C35A C57=C57A C58=C58A C59=C59A C60=C60A C61=C61A C62=C62A C69=C69A C70=C70A C71=C71A C72=C72A C73=C73A C74=C74A D1=D1A D2=D2A D3=D3A D4=D4A D5=D5A D6=D6A D7=D7A D8=D8A R17=R17A R22=R22A R24=R24A R26=R26A R27=R27A R28=R28A R29=R29A R30=R30A R31=R31A R32=R32A R33=R33A R34=R34A R35=R35A R36=R36A R37=R37A R38=R38A R39=R39A R40=R40A R41=R41A R42=R42A R43=R43A R44=R44A R45=R45A R46=R46A R47=R47A R48=R48A R49=R49A R50=R50A R51=R51A R52=R52A R53=R53A R54=R54A R55=R55A R56=R56A R57=R57A R58=R58A R59=R59A R60=R60A R61=R61A R62=R62A R63=R63A R64=R64A R65=R65A R66=R66A R67=R67A R68=R68A R69=R69A R70=R70A R71=R71A R72=R72A R73=R73A R74=R74A R75=R75A R76=R76A R77=R77A R78=R78A R79=R79A R80=R80A R81=R81A R82=R82A R83=R83A R84=R84A R85=R85A R86=R86A R87=R87A U1=U1A#1; ports IN_N=IN_N PDN_GBL=PDN_GBL RESET=RESET TX_TRIG=TX_TRIG
U_AFE_1: designators B6=B6B B7=B7B B8=B8B B9=B9B B10=B10B B11=B11B B12=B12B B13=B13B B15=B15B C1=C1B C2=C2B C3=C3B C4=C4B C5=C5B C6=C6B C9=C9B C14=C14B C15=C15B C26=C26B C27=C27B C33=C33B C34=C34B C35=C35B C57=C57B C58=C58B C59=C59B C60=C60B C61=C61B C62=C62B C69=C69B C70=C70B C71=C71B C72=C72B C73=C73B C74=C74B D1=D1B D2=D2B D3=D3B D4=D4B D5=D5B D6=D6B D7=D7B D8=D8B R17=R17B R22=R22B R24=R24B R26=R26B R27=R27B R28=R28B R29=R29B R30=R30B R31=R31B R32=R32B R33=R33B R34=R34B R35=R35B R36=R36B R37=R37B R38=R38B R39=R39B R40=R40B R41=R41B R42=R42B R43=R43B R44=R44B R45=R45B R46=R46B R47=R47B R48=R48B R49=R49B R50=R50B R51=R51B R52=R52B R53=R53B R54=R54B R55=R55B R56=R56B R57=R57B R58=R58B R59=R59B R60=R60B R61=R61B R62=R62B R63=R63B R64=R64B R65=R65B R66=R66B R67=R67B R68=R68B R69=R69B R70=R70B R71=R71B R72=R72B R73=R73B R74=R74B R75=R75B R76=R76B R77=R77B R78=R78B R79=R79B R80=R80B R81=R81B R82=R82B R83=R83B R84=R84B R85=R85B R86=R86B R87=R87B U1=U1B#1; ports IN_N=IN_N PDN_GBL=PDN_GBL RESET=RESET TX_TRIG=TX_TRIG
U_AFE_2: designators B6=B6C B7=B7C B8=B8C B9=B9C B10=B10C B11=B11C B12=B12C B13=B13C B15=B15C C1=C1C C2=C2C C3=C3C C4=C4C C5=C5C C6=C6C C9=C9C C14=C14C C15=C15C C26=C26C C27=C27C C33=C33C C34=C34C C35=C35C C57=C57C C58=C58C C59=C59C C60=C60C C61=C61C C62=C62C C69=C69C C70=C70C C71=C71C C72=C72C C73=C73C C74=C74C D1=D1C D2=D2C D3=D3C D4=D4C D5=D5C D6=D6C D7=D7C D8=D8C R17=R17C R22=R22C R24=R24C R26=R26C R27=R27C R28=R28C R29=R29C R30=R30C R31=R31C R32=R32C R33=R33C R34=R34C R35=R35C R36=R36C R37=R37C R38=R38C R39=R39C R40=R40C R41=R41C R42=R42C R43=R43C R44=R44C R45=R45C R46=R46C R47=R47C R48=R48C R49=R49C R50=R50C R51=R51C R52=R52C R53=R53C R54=R54C R55=R55C R56=R56C R57=R57C R58=R58C R59=R59C R60=R60C R61=R61C R62=R62C R63=R63C R64=R64C R65=R65C R66=R66C R67=R67C R68=R68C R69=R69C R70=R70C R71=R71C R72=R72C R73=R73C R74=R74C R75=R75C R76=R76C R77=R77C R78=R78C R79=R79C R80=R80C R81=R81C R82=R82C R83=R83C R84=R84C R85=R85C R86=R86C R87=R87C U1=U1C#1; ports IN_N=IN_N PDN_GBL=PDN_GBL RESET=RESET TX_TRIG=TX_TRIG
U_AFE_3: designators B6=B6D B7=B7D B8=B8D B9=B9D B10=B10D B11=B11D B12=B12D B13=B13D B15=B15D C1=C1D C2=C2D C3=C3D C4=C4D C5=C5D C6=C6D C9=C9D C14=C14D C15=C15D C26=C26D C27=C27D C33=C33D C34=C34D C35=C35D C57=C57D C58=C58D C59=C59D C60=C60D C61=C61D C62=C62D C69=C69D C70=C70D C71=C71D C72=C72D C73=C73D C74=C74D D1=D1D D2=D2D D3=D3D D4=D4D D5=D5D D6=D6D D7=D7D D8=D8D R17=R17D R22=R22D R24=R24D R26=R26D R27=R27D R28=R28D R29=R29D R30=R30D R31=R31D R32=R32D R33=R33D R34=R34D R35=R35D R36=R36D R37=R37D R38=R38D R39=R39D R40=R40D R41=R41D R42=R42D R43=R43D R44=R44D R45=R45D R46=R46D R47=R47D R48=R48D R49=R49D R50=R50D R51=R51D R52=R52D R53=R53D R54=R54D R55=R55D R56=R56D R57=R57D R58=R58D R59=R59D R60=R60D R61=R61D R62=R62D R63=R63D R64=R64D R65=R65D R66=R66D R67=R67D R68=R68D R69=R69D R70=R70D R71=R71D R72=R72D R73=R73D R74=R74D R75=R75D R76=R76D R77=R77D R78=R78D R79=R79D R80=R80D R81=R81D R82=R82D R83=R83D R84=R84D R85=R85D R86=R86D R87=R87D U1=U1D#1; ports IN_N=IN_N PDN_GBL=PDN_GBL RESET=RESET TX_TRIG=TX_TRIG

### Buses and harness runs
bus INP[31..0] = port INP[31..0]

### Layout directives
differential pair: ADC_CLK_N, ADC_CLK_P, ADCCLK_N_U_AFE_0, ADCCLK_P_U_AFE_0, DCLK_N, DCLK_P, DOUT0_N, DOUT0_P, DOUT1_N, DOUT1_P, DOUT2_N, DOUT2_P, DOUT3_N, DOUT3_P, DOUT4_N, DOUT4_P, DOUT5_N, DOUT5_P, DOUT6_N, DOUT6_P, DOUT7_N, DOUT7_P, DOUT8_N, DOUT8_P, DOUT9_N, DOUT9_P, DOUT10_N, DOUT10_P, DOUT11_N, DOUT11_P, DOUT12_N, DOUT12_P, DOUT13_N, DOUT13_P, DOUT14_N, DOUT14_P, DOUT15_N, DOUT15_P, FCLK_N, FCLK_P

### Notes on the sheet
- connect K16 pin H
  https://e2e.ti.com/support/data-converters-group/data-converters/f/data-converters-forum/950212/afe5832-spi-readout-fails-sporadically/3524152?tisearch=e2e-sitesearch&keymatch=AFE5832#3524152
- Project/Equipment
- Document
- Designer
- Drawn by
- Check.by
- Copyright WUT ISE 2018.
  This documentation describes Open Hardware and is licensed under the CERN OHL v.1.1. You may redistribute and modify this documentation under the terms of the CERN OHL v.1.1. (http://ohwr.org/CERNOHL). This documentation is distributed WITHOUT ANY EXPRESS OR IMPLIED WARRANTY, INCLUDING OF MERCHANTABILITY, SATISFACTORY QUALITY AND FITNESS FOR A PARTICULAR PURPOSE. Please see the CERN OHL v.1.1 for applicable conditions.
- Contact
- File
- Last Mod.
- Print Date
- Sheet
- Size
- A3
- of
- Rev

### Library data of the parts
B6-B13 B15 = SMD_PAD_D0.75MM: Through Hole Pad; Part Description: 0.75mm Diameter SMD Pad; Mounted: No; Part Number: SMD_PAD_D0.75MM; Component Type: Standard (No BOM); Pin Count: 1; Family: SMD Pad; Socket: No; SMD: No; Sense: No; Status: None; ComponentHeight: 0mm; HelpURL: Undefined; Author: CERN DEM BC; CreateDate: 04.06.2020; LatestRevisionDate: 04.06.2020; PackageDescription: 0.75mm Diameter SMD Pad
C1-C4 C6 C14 C15 C26 C27 C33-C35 C57-C62 C69-C74 = CC0402_1UF_25V_10%_X5R: Non-polarised capacitor; Part Description: SMD Multilayer Chip Ceramic Capacitor; Manufacturer: GENERIC; Manufacturer1 Part Number: C1005X5R1E105K050; Voltage: 25V; TC: X5R; Tolerance: ±10%; Part Number: CC0402_1UF_25V_10%_X5R; Component Kind: Standard; Component Type: Standard; Pin Count: 2; Value: 1uF; Status: Preferred; Manufacturer Part Number: CC0402_1UF_25V_10%_X5R; Case: 0402; Mounted: Yes; Socket: No; SMD: Yes; Sense: No; Manufacturer1 Example: TDK; Manufacturer1 ComponentHeight: 0.55mm; HelpURL: \\cern.ch\dfs\Applications\Altium\Datasheets\CC0402_X5R_TDK_C.pdf; Author: CERN DEM BC; CreateDate: 17.02.2020; LatestRevisionDate: 17.02.2020
C5 C9 = CC0201_100NF_6.3V_10%_X5R: Non-polarised capacitor; Part Description: SMD Multilayer Chip Ceramic Capacitor; Manufacturer: GENERIC; Manufacturer1 Part Number: 02016D104KAT2A; Voltage: 6.3V; TC: X5R; Tolerance: ±10%; Part Number: CC0201_100NF_6.3V_10%_X5R; Component Kind: Standard; Component Type: Standard; Pin Count: 2; Value: 100nF; Status: Not Recommended; Manufacturer Part Number: CC0201_100NF_6.3V_10%_X5R; Case: 0201; Mounted: Yes; Socket: No; SMD: Yes; Sense: No; Manufacturer1 Example: AVX; Manufacturer1 ComponentHeight: 0.33mm; HelpURL: \\cern.ch\dfs\Applications\Altium\Datasheets\CC0201_X5R_AVX.pdf; Author: CERN DEM JLC; CreateDate: 03.12.2007; LatestRevisionDate: 03.12.2007
D1-D8 = D_TVS_D1213A-04S-7: Integrated Quad Ultra-Low Capacitance ESD Protection; Part Description: Integrated Quad Ultra-Low Capacitance ESD (±8kV) Protection; Manufacturer: DIODES; PressFit: No; Bonding: No; Status Comment: Active; Part Number: D1213A-04S-7; Component Kind: Standard; Component Type: Standard; Device: D1213A-04S-7; PackageDescription: SOT363, SC70-6, 0.65mm Pitch; 6 Pin, 1.25mm W X 2.00mm L X 1.10mm H body, IPC Medium Density; Status: Active; Manufacturer Part Number: D1213A-04S-7; Pin Count: 6; Case: SOT363; Mounted: Yes; Socket: No; SMD: Yes; Sense: No; ComponentHeight: 1.1mm; HelpURL: \\cern.ch\dfs\Applications\Altium\Datasheets\PRTR5V0U4Y.pdf; Author: GK; CreateDate: 24.01.2017; LatestRevisionDate: 14.09.2020
R17 = R0402_100R_1%_0.0625W_100PPM: Resistor - 1%; Part Description: General Purpose Thick Film Chip Resistor; Manufacturer: GENERIC; Manufacturer1 Part Number: 232270671001L; TC: ±100ppm/°C; PressFit: No; Part Number: R0402_100R_1%_0.0625W_100PPM; Component Kind: Standard; Component Type: Standard; Pin Count: 2; Value: 100; Status: Not Recommended; Power: 0.0625W; Manufacturer Part Number: R0402_100R_1%_0.0625W_100PPM; Case: 0402; Mounted: Yes; Sense: No; Socket: No; SMD: Yes; Manufacturer1 Example: YAGEO PHYCOMP; Manufacturer1 ComponentHeight: 0.4mm; HelpURL: \\cern.ch\dfs\Applications\Altium\Datasheets\R0402_Phycomp_RC0402.pdf; Author: CERN DEM JLC; CreateDate: 03.12.2007; LatestRevisionDate: 17.10.2012
R22 R27 R28 R31 R32 R35 R36 R39 R40 R43 R44 R47 R48 R51 R52 R55 R56 R59 R60 R63 R64 R67 R68 R71 R72 R75 R76 R79 R80 R83 R84 R87 = R0201_49R9_1%_0.05W_200PPM: Resistor - 1%; Part Description: Thick Film Chip Resistor; Manufacturer: GENERIC; Manufacturer1 Part Number: CRCW020149R9FNED; Power: 0.05W; TC: ±200ppm/°C; PressFit: No; Part Number: R0201_49R9_1%_0.05W_200PPM; Component Kind: Standard; Component Type: Standard; Pin Count: 2; Value: 49R9; Status: Not Recommended; Manufacturer Part Number: R0201_49R9_1%_0.05W_200PPM; Case: 0201; Mounted: Yes; Sense: No; Socket: No; SMD: Yes; Manufacturer1 Example: VISHAY; Manufacturer1 ComponentHeight: 0.27mm; HelpURL: \\cern.ch\dfs\Applications\Altium\Datasheets\R0201_VISHAY_CRCW e3.pdf; Author: CERN DEM BC; CreateDate: 10.01.2020; LatestRevisionDate: 10.01.2020
R24 R26 R29 R30 R33 R34 R37 R38 R41 R42 R45 R46 R49 R50 R53 R54 R57 R58 R61 R62 R65 R66 R69 R70 R73 R74 R77 R78 R81 R82 R85 R86 = R0201_100R_1%_0.05W_200PPM: Resistor - 1%; Part Description: Thick Film Chip Resistor; Manufacturer: GENERIC; Manufacturer1 Part Number: CRCW0201100RFNED; Power: 0.05W; TC: ±200ppm/°C; PressFit: No; Part Number: R0201_100R_1%_0.05W_200PPM; Component Kind: Standard; Component Type: Standard; Pin Count: 2; Value: 100; Status: Not Recommended; Manufacturer Part Number: R0201_100R_1%_0.05W_200PPM; Case: 0201; Mounted: Yes; Sense: No; Socket: No; SMD: Yes; Manufacturer1 Example: VISHAY; Manufacturer1 ComponentHeight: 0.27mm; HelpURL: \\cern.ch\dfs\Applications\Altium\Datasheets\R0201_VISHAY_CRCW e3.pdf; Author: CERN DEM JLC; CreateDate: 13.11.2014; LatestRevisionDate: 13.11.2014
U1 = AFE58JD32ZBV: 32-Channel Ultrasound AFE with 41.5-mW/Channel Power, 1.5nV/√Hz Noise, 12-Bit, 40-MSPS or 10-Bit, 50-MSPS output and Passive CW Mixer, ZBV0289A (NFBGA-289); Manufacturer: Texas Instruments; SymbolCreator: Altium; SizeArea_mm2: 225; SizeAreaWB_mm2: 289; SizeX_mm: 15; SizeZ_mm: 1.8; CompType: IC; U/M: EA; SymbolVersion: 2017-06-05; PartNumber: AFE5832ZBV; PackageReference: ZBV0289A; PackageDescription: NFBGA-289; MountType: SMT; SizeY_mm: 15; ComponentLink1Description: Datasheet Link; ComponentLink1URL: https://sps06.itg.ti.com/sites/KMS/crossdivteams/altium/docs/ComponentDatasheets/AFE58JD32_Rev1.2.pdf; Publisher: Texas Instruments; LatestRevisionDate: 2017-06-06; Alternate Manufacturer: Texas Instruments

## Sheet AFE_32_SUP.SchDoc: FMC ADC 128CH 10B
size 420 x 297 mm; Author: G.Kasprowicz; CompanyName: WUT ISE; DrawnBy: G.Kasprowicz; Organization: WUT ISE; Address1: PW ISE; Address2: Nowowiejska 15/19 00-665 Warsaw; Address3: gkasprow@gmail.com; DocumentNumber: 3; Revision: 1; SheetNumber: 3; SheetTotal: 9; ModifiedBy: -; CheckedDate: -; Title2: AFE 32 SUP; DivGrp: WUT ISE; Designer: G.Kasprowicz; ModifiedDate: -; ProjectName: Sensor Box
Used 4 times, as channels U_AFE_0/U_AFE_32_SUP, U_AFE_1/U_AFE_32_SUP, U_AFE_2/U_AFE_32_SUP, U_AFE_3/U_AFE_32_SUP. Parts and nets are listed once, with the designators drawn on the sheet.
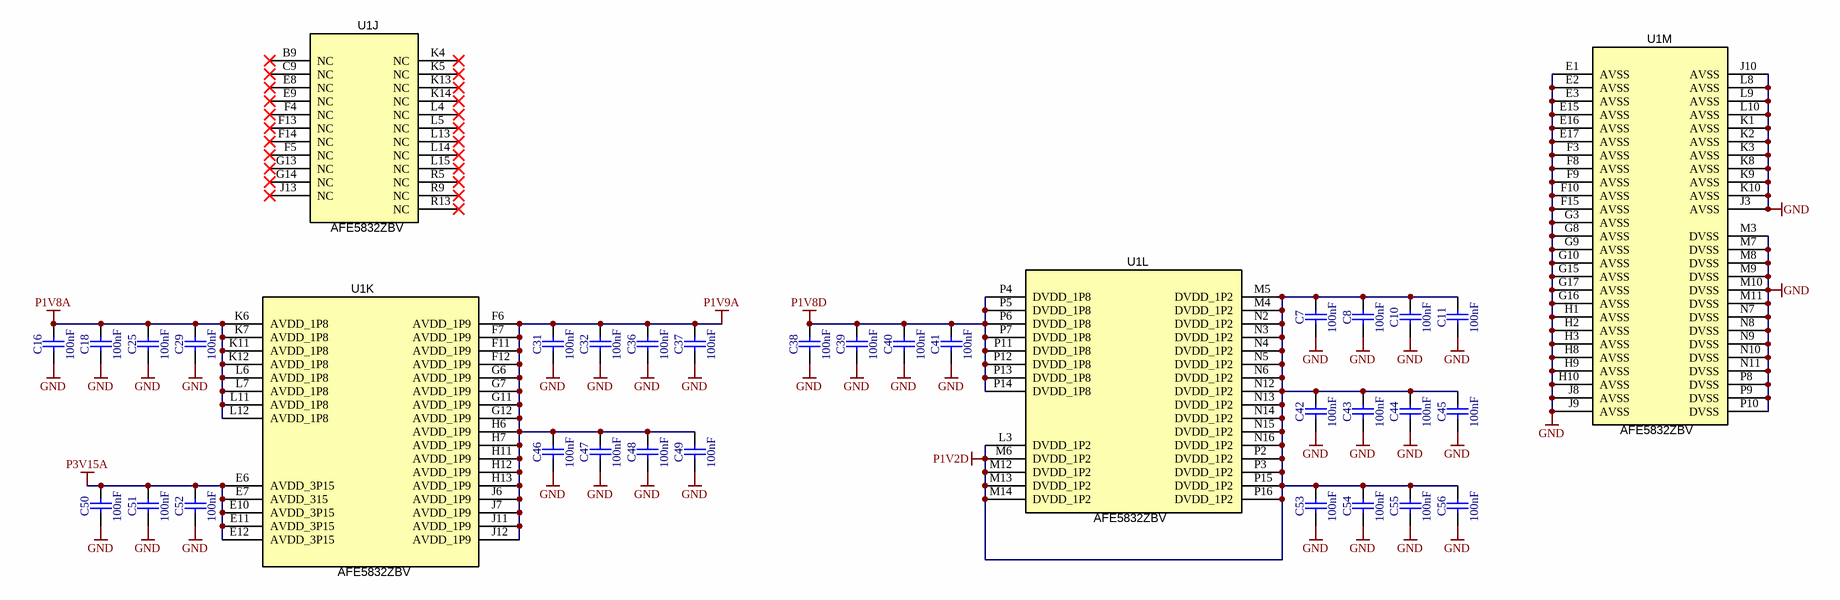
[diagram p2: AFE_32_SUP.SchDoc]

### Parts
C7  100nF  [CAPC0603X33N]
C8  100nF  [CAPC0603X33N]
C10  100nF  [CAPC0603X33N]
C11  100nF  [CAPC0603X33N]
C16  100nF  [CAPC0603X33N]
C18  100nF  [CAPC0603X33N]
C25  100nF  [CAPC0603X33N]
C29  100nF  [CAPC0603X33N]
C31  100nF  [CAPC0603X33N]
C32  100nF  [CAPC0603X33N]
C36  100nF  [CAPC0603X33N]
C37  100nF  [CAPC0603X33N]
C38  100nF  [CAPC0603X33N]
C39  100nF  [CAPC0603X33N]
C40  100nF  [CAPC0603X33N]
C41  100nF  [CAPC0603X33N]
C42  100nF  [CAPC0603X33N]
C43  100nF  [CAPC0603X33N]
C44  100nF  [CAPC0603X33N]
C45  100nF  [CAPC0603X33N]
C46  100nF  [CAPC0603X33N]
C47  100nF  [CAPC0603X33N]
C48  100nF  [CAPC0603X33N]
C49  100nF  [CAPC0603X33N]
C50  100nF  [CAPC0603X33N]
C51  100nF  [CAPC0603X33N]
C52  100nF  [CAPC0603X33N]
C53  100nF  [CAPC0603X33N]
C54  100nF  [CAPC0603X33N]
C55  100nF  [CAPC0603X33N]
C56  100nF  [CAPC0603X33N]
U1  AFE5832ZBV  [BGA289C80P17X17_1500X1500X140]  (parts J,K,L,M of 13)

### Nets
GND: C7.1 C8.1 C10.1 C11.1 C16.1 C18.1 C25.1 C29.1 C31.1 C32.1 C36.1 C37.1 C38.1 C39.1 C40.1 C41.1 C42.1 C43.1 C44.1 C45.1 C46.1 C47.1 C48.1 C49.1 C50.1 C51.1 C52.1 C53.1 C54.1 C55.1 C56.1 U1.E1(AVSS) U1.E2(AVSS) U1.E3(AVSS) U1.E15(AVSS) U1.E16(AVSS) U1.E17(AVSS) U1.F3(AVSS) U1.F8(AVSS) U1.F9(AVSS) U1.F10(AVSS) U1.F15(AVSS) U1.G3(AVSS) U1.G8(AVSS) U1.G9(AVSS) U1.G10(AVSS) U1.G15(AVSS) U1.G16(AVSS) U1.G17(AVSS) U1.H1(AVSS) U1.H2(AVSS) U1.H3(AVSS) U1.H8(AVSS) U1.H9(AVSS) U1.H10(AVSS) U1.J3(AVSS) U1.J8(AVSS) U1.J9(AVSS) U1.J10(AVSS) U1.K1(AVSS) U1.K2(AVSS) U1.K3(AVSS) U1.K8(AVSS) U1.K9(AVSS) U1.K10(AVSS) U1.L8(AVSS) U1.L9(AVSS) U1.L10(AVSS) U1.M3(DVSS) U1.M7(DVSS) U1.M8(DVSS) U1.M9(DVSS) U1.M10(DVSS) U1.M11(DVSS) U1.N7(DVSS) U1.N8(DVSS) U1.N9(DVSS) U1.N10(DVSS) U1.N11(DVSS) U1.P8(DVSS) U1.P9(DVSS) U1.P10(DVSS)
P1V2D: C7.2 C8.2 C10.2 C11.2 C42.2 C43.2 C44.2 C45.2 C53.2 C54.2 C55.2 C56.2 U1.L3(DVDD_1P2) U1.M4(DVDD_1P2) U1.M5(DVDD_1P2) U1.M6(DVDD_1P2) U1.M12(DVDD_1P2) U1.M13(DVDD_1P2) U1.M14(DVDD_1P2) U1.N2(DVDD_1P2) U1.N3(DVDD_1P2) U1.N4(DVDD_1P2) U1.N5(DVDD_1P2) U1.N6(DVDD_1P2) U1.N12(DVDD_1P2) U1.N13(DVDD_1P2) U1.N14(DVDD_1P2) U1.N15(DVDD_1P2) U1.N16(DVDD_1P2) U1.P2(DVDD_1P2) U1.P3(DVDD_1P2) U1.P15(DVDD_1P2) U1.P16(DVDD_1P2)
P1V8A: C16.2 C18.2 C25.2 C29.2 U1.K6(AVDD_1P8) U1.K7(AVDD_1P8) U1.K11(AVDD_1P8) U1.K12(AVDD_1P8) U1.L6(AVDD_1P8) U1.L7(AVDD_1P8) U1.L11(AVDD_1P8) U1.L12(AVDD_1P8)
P1V8D: C38.2 C39.2 C40.2 C41.2 U1.P4(DVDD_1P8) U1.P5(DVDD_1P8) U1.P6(DVDD_1P8) U1.P7(DVDD_1P8) U1.P11(DVDD_1P8) U1.P12(DVDD_1P8) U1.P13(DVDD_1P8) U1.P14(DVDD_1P8)
P1V9A: C31.2 C32.2 C36.2 C37.2 C46.2 C47.2 C48.2 C49.2 U1.F6(AVDD_1P9) U1.F7(AVDD_1P9) U1.F11(AVDD_1P9) U1.F12(AVDD_1P9) U1.G6(AVDD_1P9) U1.G7(AVDD_1P9) U1.G11(AVDD_1P9) U1.G12(AVDD_1P9) U1.H6(AVDD_1P9) U1.H7(AVDD_1P9) U1.H11(AVDD_1P9) U1.H12(AVDD_1P9) U1.H13(AVDD_1P9) U1.J6(AVDD_1P9) U1.J7(AVDD_1P9) U1.J11(AVDD_1P9) U1.J12(AVDD_1P9)
P3V15A: C50.2 C51.2 C52.2 U1.E6(AVDD_3P15) U1.E7(AVDD_315) U1.E10(AVDD_3P15) U1.E11(AVDD_3P15) U1.E12(AVDD_3P15)

Not connected (* = marked no-connect by the designer): U1 B9(NC)* C9(NC)* E8(NC)* E9(NC)* F4(NC)* F5(NC)* F13(NC)* F14(NC)* G13(NC)* G14(NC)* J13(NC)* K4(NC)* K5(NC)* K13(NC)* K14(NC)* L4(NC)* L5(NC)* L13(NC)* L14(NC)* L15(NC)* R5(NC)* R9(NC)* R13(NC)*

### Channels
U_AFE_0/U_AFE_32_SUP: designators C7=C7A C8=C8A C10=C10A C11=C11A C16=C16A C18=C18A C25=C25A C29=C29A C31=C31A C32=C32A C36=C36A C37=C37A C38=C38A C39=C39A C40=C40A C41=C41A C42=C42A C43=C43A C44=C44A C45=C45A C46=C46A C47=C47A C48=C48A C49=C49A C50=C50A C51=C51A C52=C52A C53=C53A C54=C54A C55=C55A C56=C56A U1=U1A#2
U_AFE_1/U_AFE_32_SUP: designators C7=C7B C8=C8B C10=C10B C11=C11B C16=C16B C18=C18B C25=C25B C29=C29B C31=C31B C32=C32B C36=C36B C37=C37B C38=C38B C39=C39B C40=C40B C41=C41B C42=C42B C43=C43B C44=C44B C45=C45B C46=C46B C47=C47B C48=C48B C49=C49B C50=C50B C51=C51B C52=C52B C53=C53B C54=C54B C55=C55B C56=C56B U1=U1B#2
U_AFE_2/U_AFE_32_SUP: designators C7=C7C C8=C8C C10=C10C C11=C11C C16=C16C C18=C18C C25=C25C C29=C29C C31=C31C C32=C32C C36=C36C C37=C37C C38=C38C C39=C39C C40=C40C C41=C41C C42=C42C C43=C43C C44=C44C C45=C45C C46=C46C C47=C47C C48=C48C C49=C49C C50=C50C C51=C51C C52=C52C C53=C53C C54=C54C C55=C55C C56=C56C U1=U1C#2
U_AFE_3/U_AFE_32_SUP: designators C7=C7D C8=C8D C10=C10D C11=C11D C16=C16D C18=C18D C25=C25D C29=C29D C31=C31D C32=C32D C36=C36D C37=C37D C38=C38D C39=C39D C40=C40D C41=C41D C42=C42D C43=C43D C44=C44D C45=C45D C46=C46D C47=C47D C48=C48D C49=C49D C50=C50D C51=C51D C52=C52D C53=C53D C54=C54D C55=C55D C56=C56D U1=U1D#2

### Notes on the sheet
- Project/Equipment
- Document
- Designer
- Drawn by
- Check.by
- Copyright WUT ISE 2018.
  This documentation describes Open Hardware and is licensed under the CERN OHL v.1.1. You may redistribute and modify this documentation under the terms of the CERN OHL v.1.1. (http://ohwr.org/CERNOHL). This documentation is distributed WITHOUT ANY EXPRESS OR IMPLIED WARRANTY, INCLUDING OF MERCHANTABILITY, SATISFACTORY QUALITY AND FITNESS FOR A PARTICULAR PURPOSE. Please see the CERN OHL v.1.1 for applicable conditions.
- Contact
- File
- Last Mod.
- Print Date
- Sheet
- Size
- A3
- of
- Rev

### Library data of the parts
C7 C8 C10 C11 C16 C18 C25 C29 C31 C32 C36-C56 = CC0201_100NF_6.3V_10%_X7R: Non-polarised capacitor; Part Description: SMD Multilayer Chip Ceramic Capacitor; Manufacturer: GENERIC; Manufacturer1 Part Number: CC0201KRX7R5BB104; Voltage: 6.3V; TC: X7R; Tolerance: ±10%; Part Number: CC0201_100NF_6.3V_10%_X7R; Component Kind: Standard; Component Type: Standard; Pin Count: 2; Value: 100nF; Status: Not Recommended; Manufacturer Part Number: CC0201_100NF_6.3V_10%_X7R; Case: 0201; Mounted: Yes; Socket: No; SMD: Yes; Sense: No; Manufacturer1 Example: YAGEO PHYCOMP; Manufacturer1 ComponentHeight: 0.33mm; HelpURL: \\cern.ch\dfs\Applications\Altium\Datasheets\CC0201_X7R_YAGEO_6.3VTO50V.pdf; Author: CERN DEM BC; CreateDate: 20.11.2020; LatestRevisionDate: 20.11.2020
U1 = AFE58JD32ZBV: as U1 on sheet AFE_32; SymbolVersion: 2017-06-05; PartNumber: AFE5832ZBV; PackageReference: ZBV0289A; PackageDescription: NFBGA-289; MountType: SMT; SizeY_mm: 15; ComponentLink1Description: Datasheet Link; ComponentLink1URL: https://sps06.itg.ti.com/sites/KMS/crossdivteams/altium/docs/ComponentDatasheets/AFE58JD32_Rev1.2.pdf; Publisher: Texas Instruments; LatestRevisionDate: 2017-06-06; Alternate Manufacturer: Texas Instruments